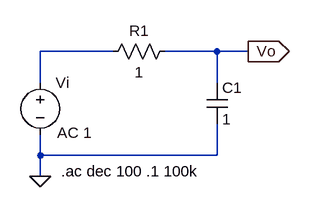
[diagram p0: schematic passive_filter_low_pass.asc]
passive_filter_low_pass.asc, the LTspice schematic file:
Version 4
SHEET 1 880 680
WIRE 160 96 48 96
WIRE 320 96 240 96
WIRE 368 96 320 96
WIRE 48 144 48 96
WIRE 320 144 320 96
WIRE 48 256 48 224
WIRE 320 256 320 208
WIRE 320 256 48 256
WIRE 48 288 48 256
FLAG 48 288 0
FLAG 368 96 Vo
IOPIN 368 96 Out
SYMBOL voltage 48 128 R0
WINDOW 123 26 93 Left 2
WINDOW 39 0 0 Left 2
SYMATTR Value2 AC 1
SYMATTR InstName Vi
SYMATTR Value ""
SYMBOL res 144 112 R270
WINDOW 0 32 56 VTop 2
WINDOW 3 0 56 VBottom 2
SYMATTR InstName R1
SYMATTR Value 1
SYMBOL cap 304 144 R0
SYMATTR InstName C1
SYMATTR Value 1
TEXT 80 280 Left 2 !.ac dec 100 .1 100k

The netlist it stands for:
* passive_filter_low_pass.asc
Vi N001 0 AC 1
R1 N001 Vo 1
C1 Vo 0 1
.ac dec 100 .1 100k
.backanno
.end